# EasyEDA schematic Stockwaage.json
TITLE: Stockwaage: Controller u. Sensoren; REV: 1.7; Date: 2019-02-10; Sheet: 1/1; Drawn By: Stefan Burkhardt; Company: Private
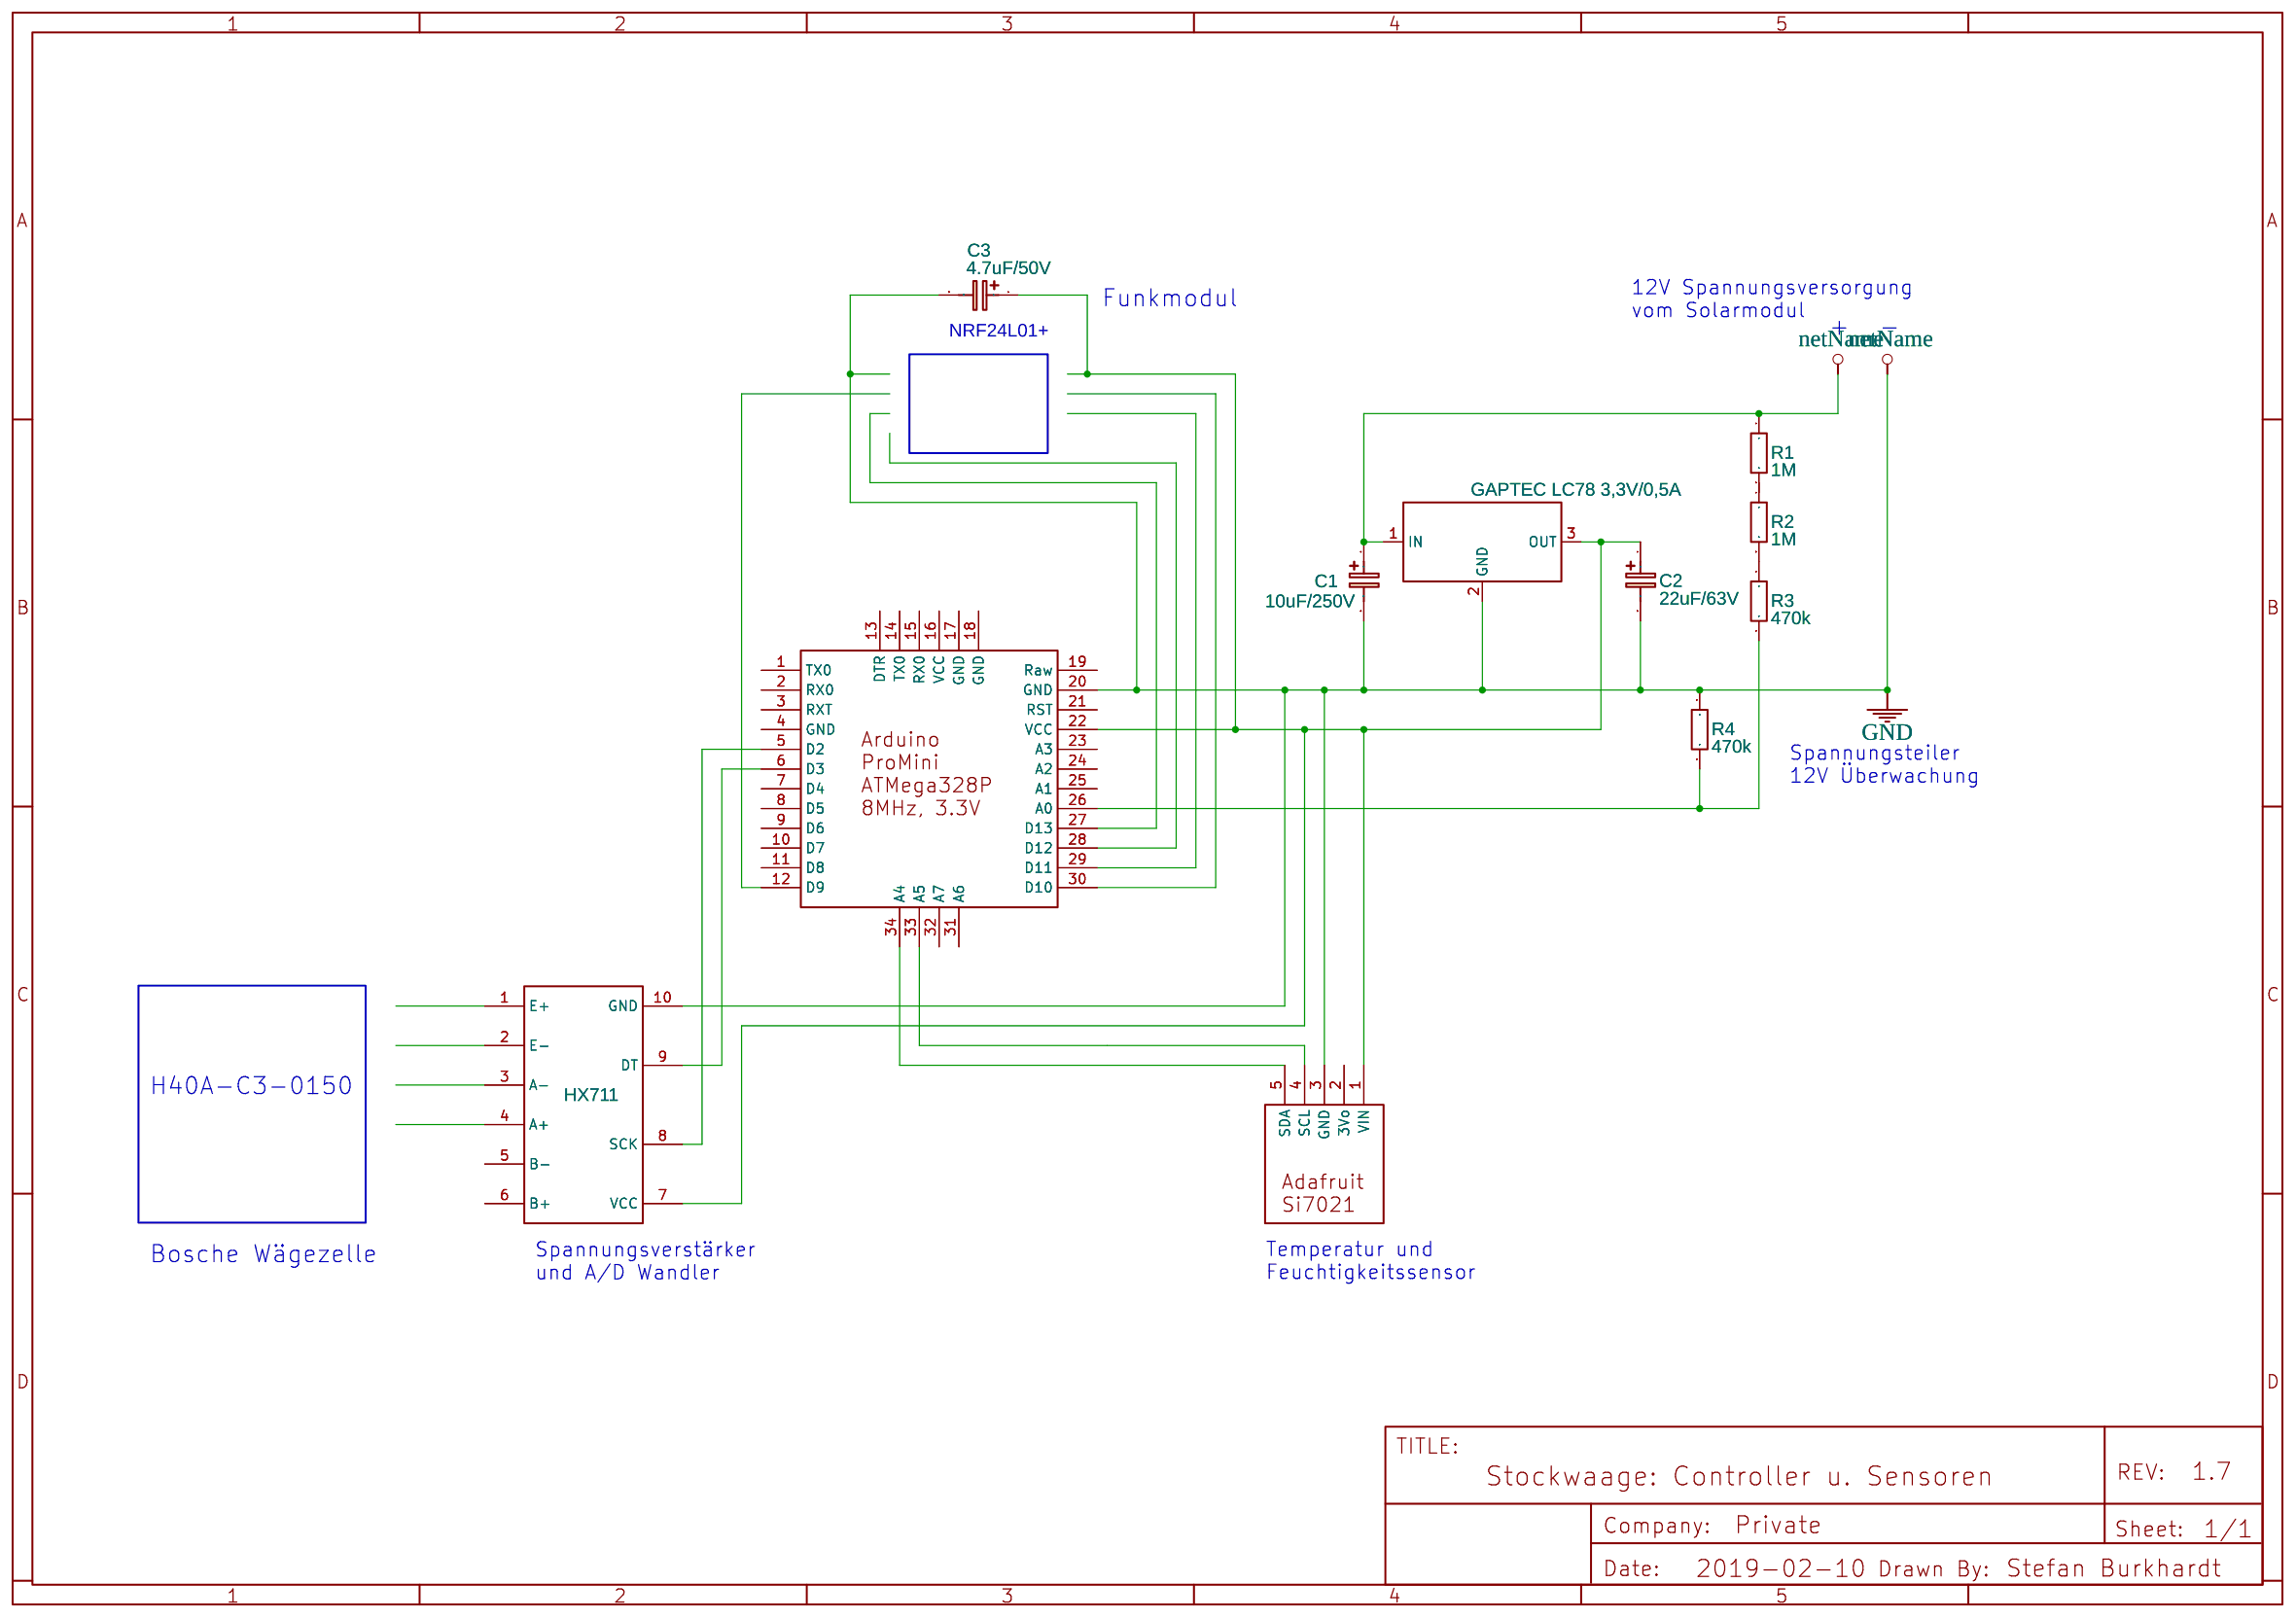
[diagram p0: schematic sheet]

## Parts
C1  10uF/250V  [CAP-D3.0XF1.5]
C2  22uF/63V  [CAP-D3.0XF1.5]
C3  4.7uF/50V  [CAP-D3.0XF1.5]
R1  1M  [AXIAL-0.3]
R2  1M  [AXIAL-0.3]
R3  470k  [AXIAL-0.3]
R4  470k  [AXIAL-0.3]
U1  Arduino ProMini ATMega328P 8MHz, 3.3V  [ARDUINO PROMINI3V3]
U2  GAPTEC LC78 3,3V/0,5A  [GAPTEC_LC78]
U3  Adafruit Si7021  [HDR-5X1-2.54]
U5  HX711  [HX711]

## Library data of the parts
C1-C3 = Cap_Electrolytic(TH)_D3.0XF1.5_EU: Contributor: EasyEDA; Manufacturer Part: ?
R1-R4 = Res_AXIAL-0.3(1/8W)_EU: Manufacturer Part: ?
U1 = -: Manufacturer Part: Arduino ProMini3v3; Contributor: ColorWolf; КОРПУС: https://easyeda.com/editor#id=!d5b057a878e247c8b098473f7093b445
U2 = -: Manufacturer Part: ?; Contributor: kbasten
U3 = -: Contributor: LucAce; Supplier Part: 3251; Supplier: Adafruit; Manufacturer Part: ?
U5 = -: Supplier: AVIA Semiconductor; Contributor: evillee1123

## Nets
GND: C1.1 C1.2 C2.2 C3.2 R1.1 R4.1 U1.20(GND) U2.1(IN) U2.2(GND) U3.3(GND) U5.10(GND)
Net-(C2-1): C2.1 C3.1 U1.22(VCC) U2.3(OUT) U3.1(VIN) U5.7(VCC)
Net-(R2-2): R2.2 R3.1
Net-(R3-2): R3.2 R4.2 U1.26(A0)
Net-(U1-5): U1.5(D2) U5.8(SCK)
Net-(U1-6): U1.6(D3) U5.9(DT)
Net-(U1-33): U1.33(A5) U3.4(SCL)
Net-(U1-34): U1.34(A4) U3.5(SDA)

Not connected (* = marked no-connect by the designer): R1 2; R2 1; U1 1(TX0) 2(RX0) 3(RXT) 4(GND) 7(D4) 8(D5) 9(D6) 10(D7) 11(D8) 12(D9) 13(DTR) 14(TX0) 15(RX0) 16(VCC) 17(GND) 18(GND) 19(Raw) 21(RST) 23(A3) 24(A2) 25(A1) 27(D13) 28(D12) 29(D11) 30(D10) 31(A6) 32(A7); U3 2(3Vo); U5 1(E+) 2(E-) 3(A-) 4(A+) 5(B-) 6(B+)

## Notes on the sheet
- Funkmodul
- 12V Spannungsversorgung
  vom Solarmodul
- +
- -
- NRF24L01+
- Spannungsteiler
  12V Überwachung
- H40A-C3-0150
- Bosche Wägezelle
- Spannungsverstärker
  und A/D Wandler
- Temperatur und
  Feuchtigkeitssensor
